# Altium schematic sheet summary.SchDoc: Summary
size A3; Author: AUTHOR; Organization: Develer srl; Address1: Via San Quirico 233/2; Address2: 50013 Campi Bisenzio; Address3: Firenze; Address4: ITALIA; Revision: A; SheetNumber: 1; SheetTotal: 2; Hw_rev: R1
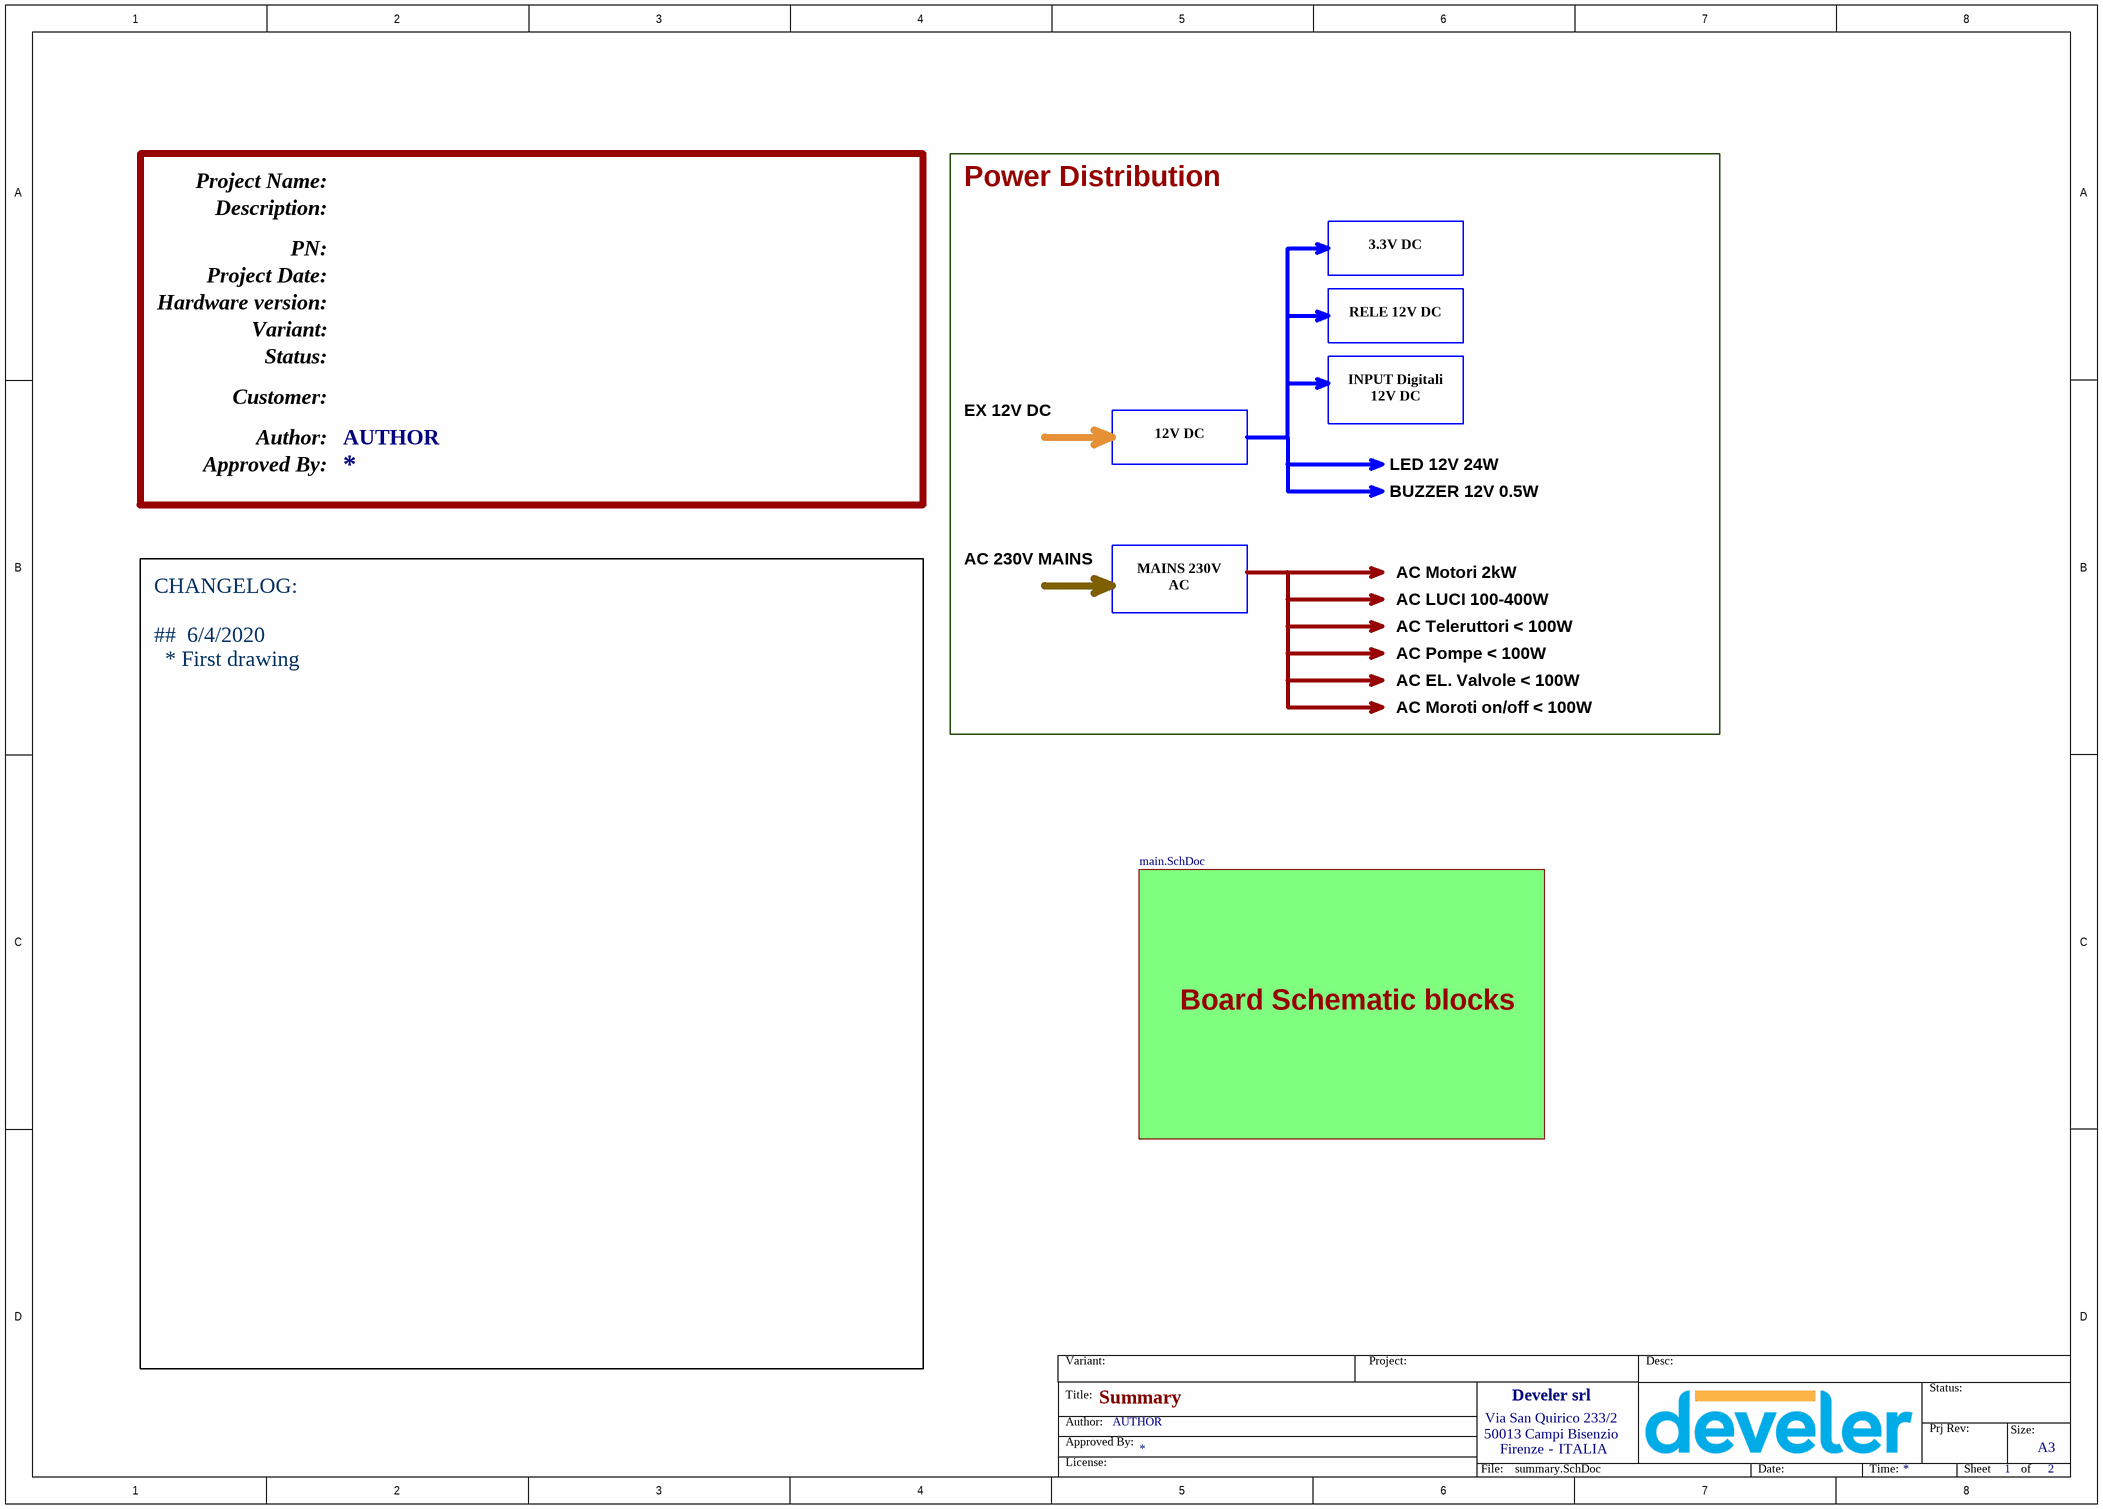
[diagram p0: summary.SchDoc]

## Sub-sheets
? = main.SchDoc: no entries

## Notes on the sheet
- Project Name:
- Description:
- PN:
- Power Distribution
- Hardware version:
- Project Date:
- 3.3V DC
- Variant:
- Status:
- RELE 12V DC
- Author:
- Customer:
- EX 12V DC
- INPUT Digitali 12V DC
- Approved By:
- 12V DC
- LED 12V 24W
- BUZZER 12V 0.5W
- AC 230V MAINS
- AC Motori 2kW
- MAINS 230V AC
- AC LUCI 100-400W
- AC Teleruttori < 100W
- AC Pompe < 100W
- AC EL. Valvole < 100W
- AC Moroti on/off < 100W
- Board Schematic blocks
- CHANGELOG:
  ##  6/4/2020
  * First drawing
- Title:
- Project:
- Desc:
- -
- Prj Rev:
- Size:
- A3
- License:
- File:
- Date:
- Time:
- Sheet
- of